# EAGLE design Domino Single Ethernet Overlap No Teardrop (EAGLE 6.5.0)
DATABASE: ./../Common/BOM/Domino_DB.txt; DRAWN: M.STEMPIN; REV: A
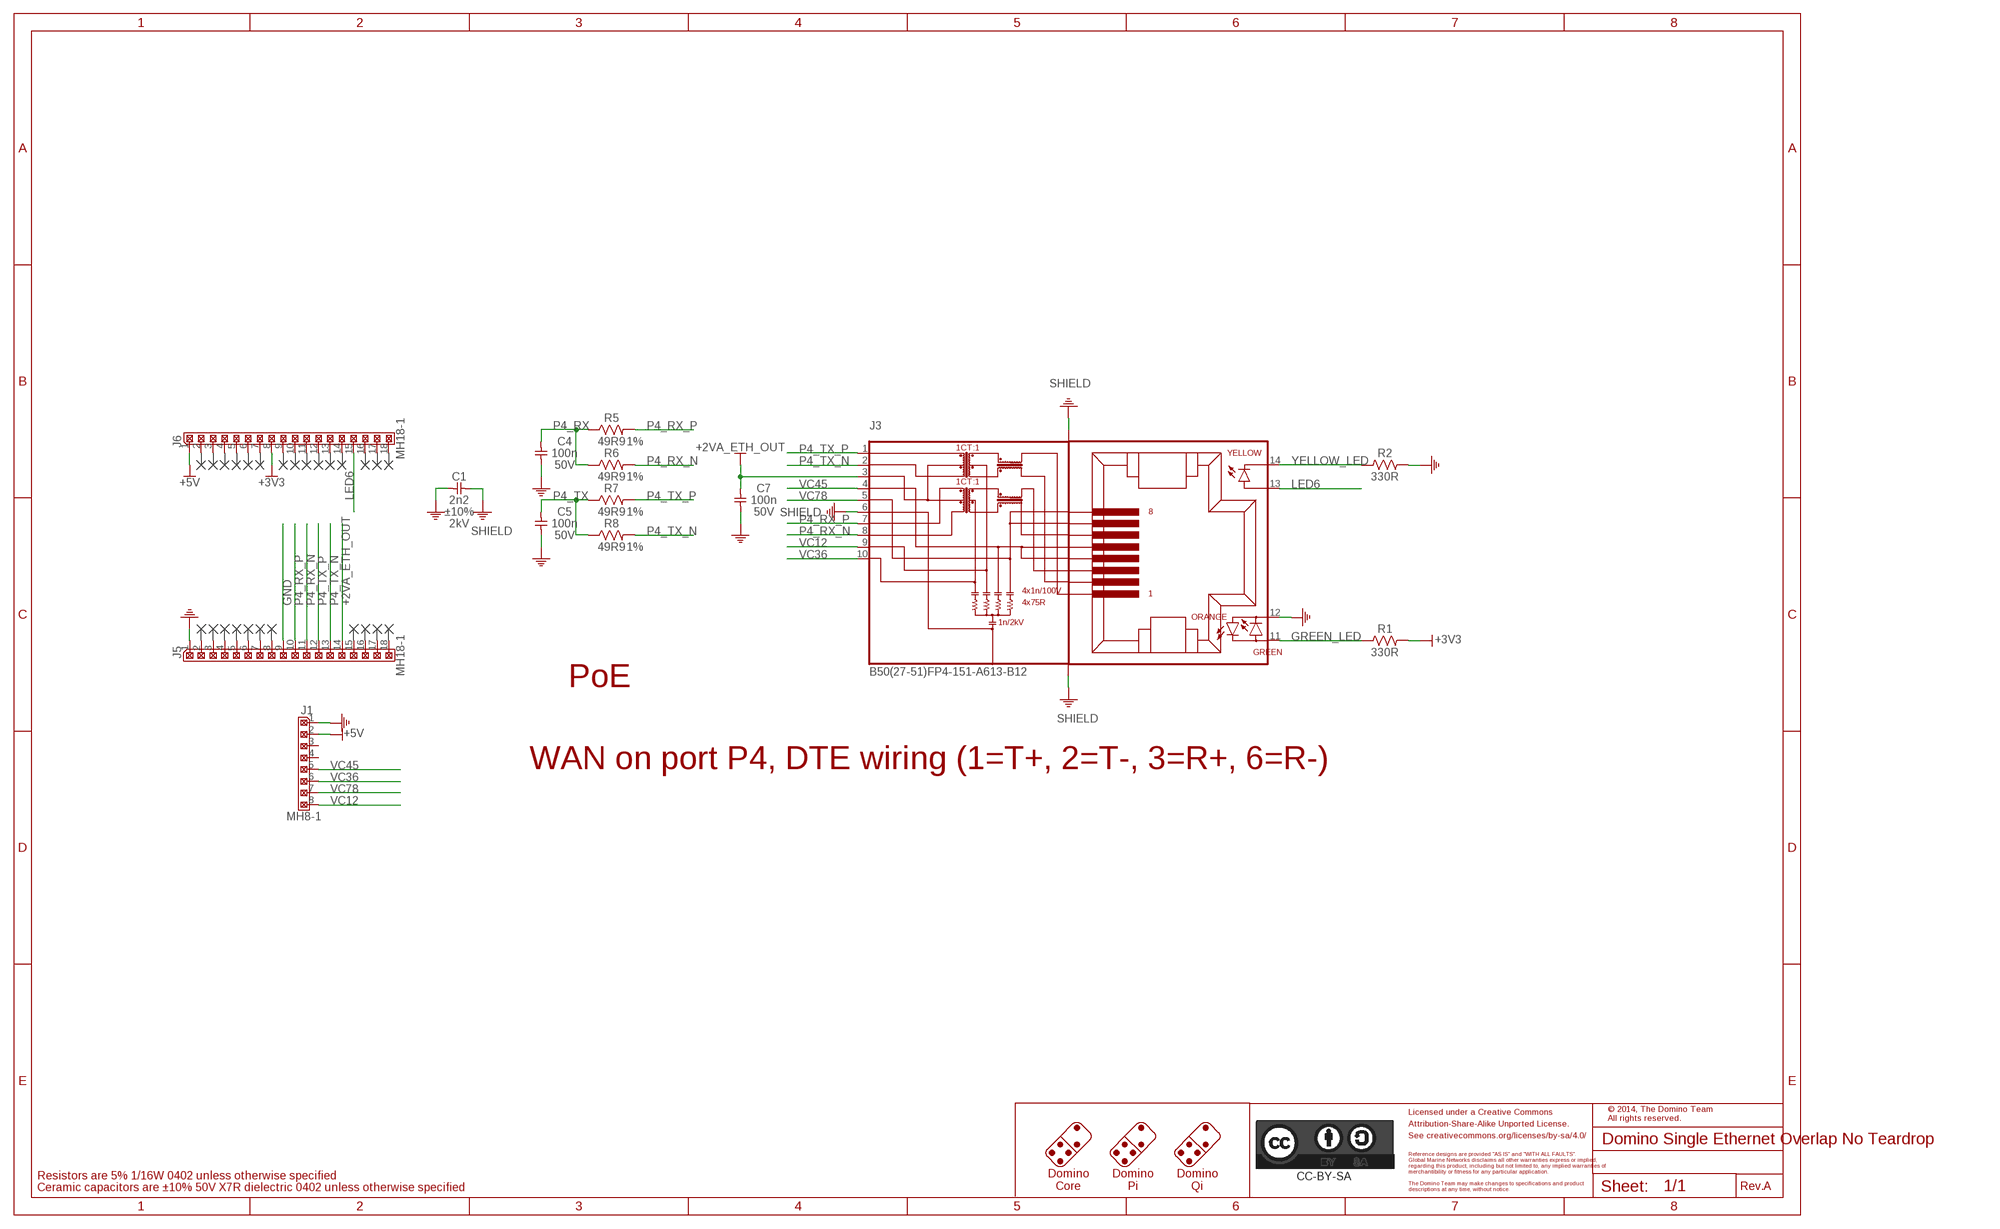
[diagram p0: schematic, sheet 1]
PORT1 (NC): BOM: EXCLUDE
PORT2 (NC): BOM: EXCLUDE
PORT3 (NC): BOM: EXCLUDE
PORT4 (NC): BOM: EXCLUDE
PORT5 (NC): BOM: EXCLUDE
PORT6 (NC): BOM: EXCLUDE
PORT7 (NC): BOM: EXCLUDE
PORT10 (NC): BOM: EXCLUDE
PORT11 (NC): BOM: EXCLUDE
PORT12 (NC): BOM: EXCLUDE
PORT13 (NC): BOM: EXCLUDE
PORT14 (NC): BOM: EXCLUDE
PORT15 (NC): BOM: EXCLUDE
PORT16 (NC): BOM: EXCLUDE
PORT17 (NC): BOM: EXCLUDE
PORT18 (NC): BOM: EXCLUDE
PORT19 (NC): BOM: EXCLUDE
PORT20 (NC): BOM: EXCLUDE
PORT21 (NC): BOM: EXCLUDE
PORT22 (NC): BOM: EXCLUDE
PORT23 (NC): BOM: EXCLUDE
PORT24 (NC): BOM: EXCLUDE
PORT25 (NC): BOM: EXCLUDE
PORT26 (NC): BOM: EXCLUDE
PORT27 (NC): BOM: EXCLUDE
PORT28 (NC): BOM: EXCLUDE

## Parts
C1  2n2  CAP_1206  [C1206]
C4  100n  CAP_0402  [C0402]
C5  100n  CAP_0402  [C0402]
C7  100n  CAP_0402  [C0402]
CC-BY-SA1  CC-BY-SA_LOGO  [CC-BY-SA_LOGO]
J1  MH8-1  [MH8-1-0.1]
J3  B50(27-51)FP4-151-A613-B12  [B50(27-51)FP4-151-A613-B12]
J5  MH18-1  [MH18-1-0.1]
J6  MH18-1  [MH18-1-0.1]
R1  330R  RES_0402  [R0402]
R2  330R  RES_0402  [R0402]
R5  49R9  RES_0402  [R0402]
R6  49R9  RES_0402  [R0402]
R7  49R9  RES_0402  [R0402]
R8  49R9  RES_0402  [R0402]

## Nets
+2VA_ETH_OUT: C7.2 J3.3 J5.14
+3V3: J6.8 R1.2
+5V: J1.2 J6.1
GND: C1.1 C4.1 C5.1 C7.1 J1.1 J3.12 J5.1 J5.9 R2.2
GREEN_LED: J3.11 R1.1
LED6: J3.13 J6.15
P4_RX: C4.2 R5.1 R6.1
P4_RX_N [Ethernet]: J3.8 J5.11 R6.2
P4_RX_P [Ethernet]: J3.7 J5.10 R5.2
P4_TX: C5.2 R7.1 R8.1
P4_TX_N [Ethernet]: J3.2 J5.13 R8.2
P4_TX_P [Ethernet]: J3.1 J5.12 R7.2
SHIELD: C1.2 J3.6 J3.SH$1(SHIELD) J3.SH$2(SHIELD)
VC12 [PoE]: J1.8 J3.9
VC36 [PoE]: J1.6 J3.10
VC45 [PoE]: J1.5 J3.4
VC78 [PoE]: J1.7 J3.5
YELLOW_LED: J3.14 R2.1
Unconnected: J1.3 J1.4 J5.2 J5.3 J5.4 J5.5 J5.6 J5.7 J5.8 J5.15 J5.16 J5.17 J5.18 J6.2 J6.3 J6.4 J6.5 J6.6 J6.7 J6.9 J6.10 J6.11 J6.12 J6.13 J6.14 J6.16 J6.17 J6.18

## Notes on the sheet
- PoE
- WAN on port P4, DTE wiring (1=T+, 2=T-, 3=R+, 6=R-)
- Licensed under a Creative Commons
- © 2014, The Domino Team
  All rights reserved.
- Attribution-Share-Alike Unported License.
- See creativecommons.org/licenses/by-sa/4.0/
- Reference designs are provided "AS IS" and "WITH ALL FAULTS".
- Global Marine Networks disclaims all other warranties express or implied,
- regarding this product, including but not limited to, any implied warranties of
- merchantibility or fitness for any particular application.
- Resistors are 5% 1/16W 0402 unless otherwise specified
- Domino
  Core
- Domino
  Pi
- Domino
  Qi
- The Domino Team may make changes to specifications and product
- Ceramic capacitors are ±10% 50V X7R dielectric 0402 unless otherwise specified | descriptions at any time, without notice. | Rev.

## Library data of the parts
C1 = Domino:CAP_: Capacitor; PARTNO: C1210_2n2_X7R_10%_CER_2kV; SIZE: 1206; TC: X7R; TOL: ±10%; TYPE: CER; VOLT: 2kV
C4 C5 C7 = Domino:CAP_: Capacitor; PARTNO: C0402_100n_X7R_10%_CER_50V; SIZE: 0402; TC: X7R; TOL: ±10%; TYPE: CER; VOLT: 50V
CC-BY-SA1 = Domino:CC-BY-SA_LOGO: Attribution-Share-Alike Unported License See creativecommons.org/licenses/by-sa/3.0/ for details.; BOM: EXCLUDE
J1 = Domino:MH8-1: 8x1 Pin Male Header
J3 = Domino:B50(27-51)FP4-151-A613-B12: Single Port RJ45 100Base-T with PoE, Transformer, 1 Magnetic Ring, 15 Pins, 3 LEDs (Left Orange/Green, Right Yellow) Without Shielding Shell Shrapnel, 3µ Gold, Pin Back, PA66 material, No Logo; PARTNO: B50(27-51)FP4-151-A613-B12
J5 J6 = Domino:MH18-1: 18x1 Pin Male Header
R1 R2 = Domino:RES_: Resistor; PARTNO: R0402_330R_5%_62.5mW; RATE: 62.5mW; SIZE: 0402; TOL: 5%
R5-R8 = Domino:RES_: Resistor; PARTNO: R0402_49R9_1%_62.5mW; RATE: 62.5mW; SIZE: 0402; TOL: 1%

## Net classes
1 Ethernet: width 0.254 mm, clearance 0.152 mm to class 0, clearance 0.152 mm
2 PoE: width 0.457 mm, clearance 0.254 mm to class 0, clearance 0.254 mm to class 1, clearance 0.254 mm

## Board
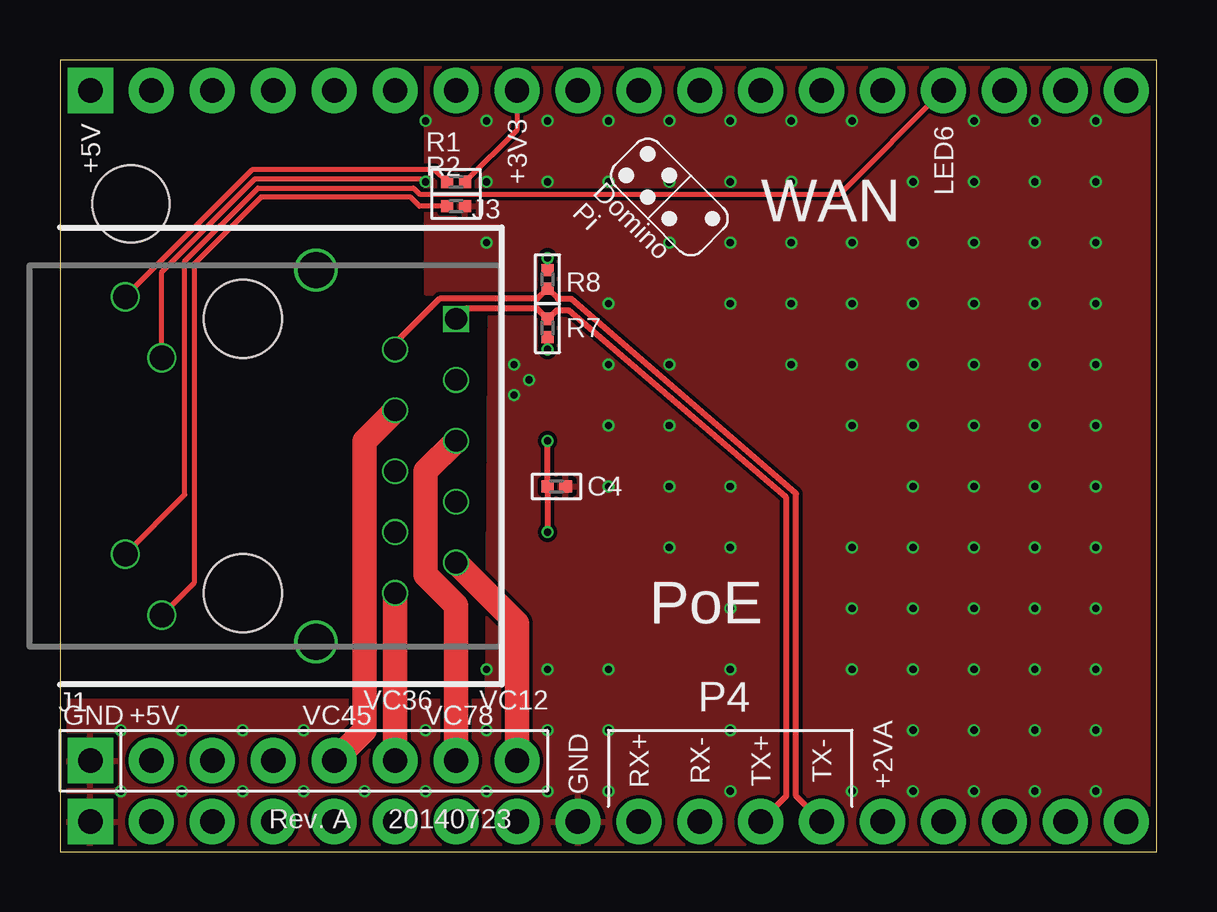
[diagram p1: board, top side]
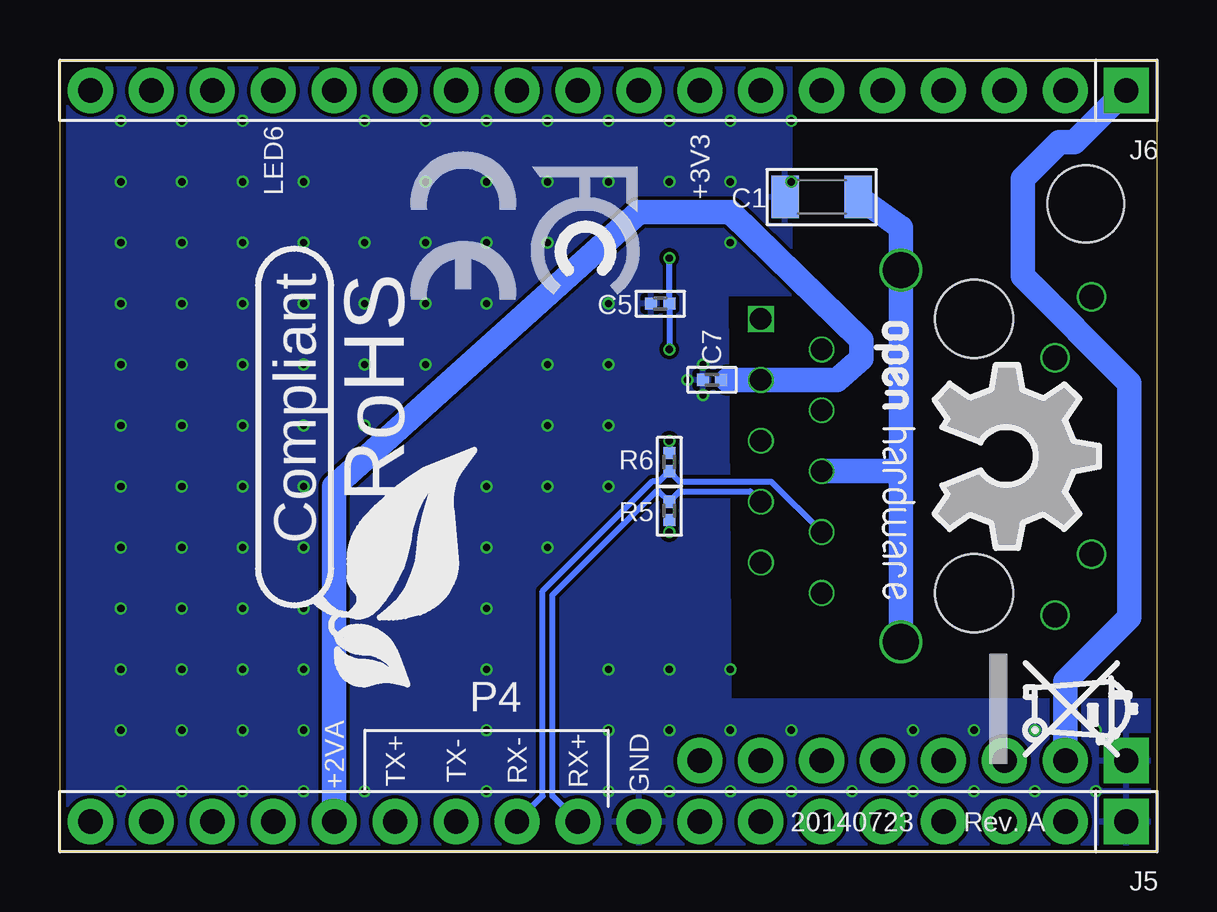
[diagram p2: board, bottom side, seen from below]

Size 45.72 x 33.02 mm. Coordinates in mm from the lower left corner, seen from the top.
Outline: 0,0 45.72,0 45.72,33.02 0,33.02 0,0
Copper layers (1*16): Top 0.043mm / dielectric 1mm / Bottom 0.043mm
Design rules "Domino": minimum track width 0.1mm, minimum drill 0.3mm, track to track 6mil, track to pad 6mil, pad to pad 6mil, via to via 6mil, smd to smd 0mil, copper to edge 0.25mm, drill to drill 0.35mm, minimum pad ring 0.085mm, minimum via ring 0.1mm, stop-mask expansion 0mil, vias tented up to drill 0.45mm, thermal gap 0.2mm
Holes 3.2 mm at 2.96,27.02

### Footprints (pad centres in the part's own frame; a part is rotated, then mirrored left to right if it is on the bottom)
C1206 = smd 1.143 x 1.778: 1 -1.524,0; 2 1.524,0
C0402 = smd 0.508 x 0.508: 1 -0.381,0; 2 0.381,0
MH8-1-0.1 = drill 1.016 pad 1.88 square: 1 0,0 | drill 1.016 pad 1.88: 2 2.54,0; 3 5.08,0; 4 7.62,0; 5 10.16,0; 6 12.7,0; 7 15.24,0; 8 17.78,0
B50(27-51)FP4-151-A613-B12 = drill 0.9 square: 1 -5.715,8.89 | drill 0.9: 2 -4.445,6.35; 3 -3.175,8.89; 4 -1.905,6.35; 5 -0.635,8.89; 6 0.635,6.35; 7 1.905,8.89; 8 3.175,6.35; 9 4.445,8.89; 10 5.715,6.35 | drill 1.02: 11 -6.64,-4.9; 12 -4.1,-3.38; 13 4.1,-4.9; 14 6.64,-3.38 | drill 1.5: SH$1 -7.75,3.05; SH$2 7.75,3.05 | hole 3.25: -5.715,0; 5.715,0
MH18-1-0.1 = drill 1.016 pad 1.88 square: 1 0,0 | drill 1.016 pad 1.88: 2 2.54,0; 3 5.08,0; 4 7.62,0; 5 10.16,0; 6 12.7,0; 7 15.24,0; 8 17.78,0; 9 20.32,0; 10 22.86,0; 11 25.4,0; 12 27.94,0; 13 30.48,0; 14 33.02,0; 15 35.56,0; 16 38.1,0; 17 40.64,0; 18 43.18,0
R0402 = smd 0.508 x 0.508: 1 -0.381,0; 2 0.381,0

### Placement (x,y rotation side)
C1  13.97,27.3 0 bottom
C4  20.7,15.24 180 top
C5  20.7,22.86 0 bottom
C7  18.54,19.68 0 bottom
CC-BY-SA1  -5.08,-50.8 0 top  (outside the outline)
DRILEGEND  [DRILEGEND]  81.53,59.94 0 top  (outside the outline)
J1  1.27,3.81 0 top
J3  7.62,16.51 270 top
J5  1.27,1.27 180 bottom
J6  1.27,31.75 180 bottom
R1  16.51,27.94 0 top
R2  16.51,26.92 0 top
R5  20.32,14.22 90 bottom
R6  20.32,16.26 270 bottom
R7  20.32,21.84 90 top
R8  20.32,23.88 270 top
U$3  [A5L-LOC]  -55.88,-62.23 0 top  (outside the outline)
U$4  [DOMINO_LOGO_SMALL]  25.4,27.3 270 top
U$5  [CE_LOGO_SMALL]  31.11,29.21 270 bottom
U$6  [FCC_LOGO_SMALL]  26.04,28.57 270 bottom
U$7  [OPEN_HARDWARE_LOGO]  6.35,16.51 270 bottom
U$8  [RECYCLE_BIN_LOGO]  6.99,8.26 270 bottom
U$9  [ROHS_LOGO]  36.83,24.13 270 bottom

### Tracks (layer width: path | path; a pad name or v marks a point on that pad's centre or on a via)
+2VA_ETH_OUT
  Bottom 0.508: 17.91,19.68 C7.2
  Bottom 1.016: J5.14 34.29,15.24 21.59,26.67 17.78,26.67 12.32,21.34 12.32,20.57 13.34,19.68 J3.3 17.91,19.68
+3V3
  Top 0.203: J6.8 19.05,30.1 R1.2
+5V
  Bottom 1.016: J6.1 3.43,29.59 4.06,29.59 5.59,28.07 5.59,24 1.14,19.56 1.14,9.78 3.81,7.11 J1.2
GND  (via drill 0.3 pad 0.03)
  Top 0.203: J3.12 4.24,24.18 8.13,28.07 15.11,28.07 v15.24,27.94
  other vias: 15.24,30.48 17.78,30.48 20.32,30.48 22.86,30.48 25.4,30.48 27.94,30.48 30.48,30.48 33.02,30.48 35.56,27.94 30.48,27.94 27.94,27.94 25.4,27.94 22.86,27.94 20.32,27.94 17.78,27.94 17.78,25.4 22.86,22.86 25.4,25.4 27.94,25.4 30.48,25.4 33.02,25.4 35.56,25.4 35.56,22.86 30.48,22.86 35.56,20.32 35.56,17.78 22.86,15.24 35.56,15.24 35.56,12.7 35.56,10.16 35.56,7.62 27.94,7.62 22.86,5.08 27.94,5.08 33.02,2.54 27.94,2.54 22.86,2.54 20.32,2.54 27.94,15.24 20.32,7.62 22.86,7.62 20.32,5.08 33.02,20.32 33.02,17.78 33.02,12.7 33.02,10.16 33.02,7.62 35.56,5.08 27.94,10.16 17.78,7.62 17.78,5.08 17.78,2.54 35.56,2.54 38.1,2.54 40.64,2.54 43.18,2.54 38.1,5.08 40.64,5.08 43.18,5.08 38.1,7.62 40.64,7.62 43.18,7.62 38.1,10.16 40.64,10.16 43.18,10.16 38.1,12.7 40.64,12.7 43.18,12.7 38.1,15.24 40.64,15.24 43.18,15.24 38.1,17.78 40.64,17.78 43.18,17.78 38.1,20.32 40.64,20.32 43.18,20.32 38.1,22.86 40.64,22.86 43.18,22.86 38.1,25.4 40.64,25.4 43.18,25.4 38.1,27.94 40.64,27.94 43.18,27.94 38.1,30.48 40.64,30.48 43.18,30.48 15.24,5.08 10.16,5.08 7.62,5.08 5.08,5.08 2.54,5.08 2.54,2.54 5.08,2.54 7.62,2.54 10.16,2.54 12.7,2.54 15.24,2.54 19.56,19.68 18.92,20.32 18.92,19.05 27.94,22.86 30.48,20.32 25.4,20.32 33.02,22.86 27.94,12.7 25.4,12.7 25.4,15.24 25.4,17.78 22.86,17.78 22.86,20.32
  pour Top: 45.72,33.02 45.72,0 0,0 0,6.35 17.78,6.35 17.91,23.24 15.24,23.24 15.24,33.02
  pour Bottom: 45.72,33.02 45.72,0 0,0 0,6.35 17.78,6.35 17.91,23.24 15.24,23.24 15.24,33.05
GREEN_LED
  Top 0.203: J3.11 8.02,28.45 15.62,28.45 R1.1
LED6
  Top 0.203: J3.13 5.21,14.9 5.21,24.64 8.26,27.69 14.73,27.69 14.99,27.43 32.51,27.43 J6.15
P4_RX  (via drill 0.3 pad 0.03)
  Top 0.254: v20.32,13.34 C4.2 v20.32,17.14
  Bottom 0.254: v20.32,13.34 R5.1 | v20.32,17.14 R6.1
P4_RX_N
  Bottom 0.254: J3.8 16.08,15.44 19.89,15.44 R6.2 20.75,15.44 21.04,15.44 25.6,10.88 25.6,2.34 J5.11
P4_RX_P
  Bottom 0.254: J3.7 16.94,15.04 19.89,15.04 R5.2 20.75,15.04 20.87,15.04 25.2,10.71 25.2,2.34 J5.10
P4_TX  (via drill 0.3 pad 0.03)
  Top 0.254: v20.32,20.95 R7.1 | v20.32,24.77 R8.1
  Bottom 0.254: v20.32,20.95 C5.2 v20.32,24.77
P4_TX_N
  Top 0.254: J3.2 13.97,21.21 15.82,23.06 19.89,23.06 R8.2 20.75,23.06 21.29,23.06 30.68,14.94 30.68,2.34 J5.13
P4_TX_P
  Top 0.254: J3.1 16.94,22.66 19.89,22.66 R7.2 20.35,22.23 20.72,22.59 21.19,22.59 30.28,14.78 30.28,2.34 J5.12
SHIELD
  Bottom 1.016: 10.67,15.88 J3.SH$1 10.67,26.04 C1.2 | J3.6 10.67,15.88 | 10.67,15.88 J3.SH$2
VC12
  Top 1.016: J3.9 19.05,9.53 J1.8
VC36
  Top 1.016: J3.10 J1.6
VC45
  Top 1.016: J3.4 12.7,17.14 12.7,5.08 J1.5
VC78
  Top 1.016: J3.5 15.24,15.88 15.24,11.56 16.51,10.29 J1.7
YELLOW_LED
  Top 0.203: J3.14 5.59,11.22 5.59,24.51 8.38,27.3 14.61,27.3 14.99,26.92 R2.1

### Text on the board
tPlace: +5V | +3V3 | LED6 | WAN | PoE | GND | +5V | VC45 | VC36 | VC78 | VC12 | P4 | GND | RX+ | RX- | TX+ | TX- | +2VA
bPlace: +3V3 | LED6 | P4 | GND | RX+ | RX- | TX- | TX+ | +2VA
tNames: Rev. A
bNames: Rev. A
Document: DRILL CHART: TOP TO BOTTOM | LINE WIDTH IMPEDANCE CHART FOR REFERENCE | Class | Ethernet | Type | Diff Coated Coplanar Waveguide With Ground 1B | Layer | Impedance | Trace Width | Trace Separation | Ground Separation | TOP, / BOTTOM | 100 Ohms | 10 mils | 6 mils | 6 mils | STACK-UP FOR REFERENCE | LAYER 1 L1 TOP | 18 UM CU + 12.5 UM PLATING (30.5 UM) | 1.061 MM+/-10% | CORE | 1.0 MM CORE FR-4 LG 135 / INCLUDING COPPER | LAYER 4 L16 BOTTOM | 18 UM CU + 12.5 UM PLATING (30.5 UM) | NOTES: | 1. PRINTED CIRCUIT BOARD MADE FROM NEMA GRADE FR-4 TG 135 EPOXY / LAMINATE WITH 18 UM COPPER PLATING AND 1 MM THICKNESS. | 2. ALL DIMENSIONS ARE GIVEN IN MILLIMETERS EXCEPT TRACE WIDTH/SPACE. | 3. CIRCUIT PATHS ARE FOR REFERENCE ONLY. | 4. HOLE SIZES SHOWN ARE FINISHED DIAMETERS AFTER PLATING. | 5. BOARD PLATED USING REFLOW OR SIMILAR METHOD. | 6. BOARD TO HAVE WHITE SOLDER MASK ON PLATED SURFACES USING WET / FILM SR100 OR SR1010 EPOXY. / EQUIVALENT WET OR DRY FILM MAY BE USED. | 7. SILKSCREEN BOARD USING BLACK INK. DISTORTION OF SILKSCREEN / IS ACCEPTABLE OVER TRACES. EPOXY INK ON PLATED LANDS IS NOT / ACCEPTABLE | 8. THE FOLLOWING INFORMATION APPLIES TO THIS BOARD: | * 2 COPPER LAYERS | * 1 MM BOARD THICKNESS | * REQUIRES TOP AND BOTTOM SIDE SILKSCREENS | © 2014, The Domino Team. / All rights reserved. | Licensed under a Creative Commons / Attribution-Share-Alike Unported License. / See creativecommons.org/licenses/by-sa/4.0/ | Reference designs are provided "AS IS" and "WITH ALL FAULTS". / The Domino Team disclaims all other warranties express or implied, / regarding this product, including but not limited to, any implied warranties of / merchantibility or fitness for any particular application. | Domino / Core | Domino / Pi | Domino / Qi | The Domino Team may make changes to specifications and product descriptions / at any time, without notice. | Rev.
DrillLegend: LAYER-STACK
DrillLegend_01-16: 01-16
DrillLegend_01-20: 01-20
Pinout: GND | P4_RX+ | P4_RX- | P4_TX+ | P4_TX- | +2VA_ETH_OUT | Pinout (.PIN)
Component_side: Component Side (.CMP)
Solder_side: Solder side (.SOL)
Silk_screen_CMP: Silk screen CMP (.PLC)
Silk_screen_SOL: Silk screen SOL (.PLS)
Solder_stop_mask_CMP: Solder stop mask CMP (.STC)
Solder_stop_mask_SOL: Solder stop mask SOL (.STS)
Cream_frame_CMP: Cream frame CMP (.CRC)
Cream_frame_SOL: Cream frame SOL (.CRS)
Drill_data: Drill data (.DRD)
Component_Assembly_CMP: Component Assembly CMP (.ASC)
Component_Assembly_SOL: Component Assembly SOL (.ASS)
Outline: Outline (.OLN)